# Altium schematic sheet IO&RF.SchDoc
size A4
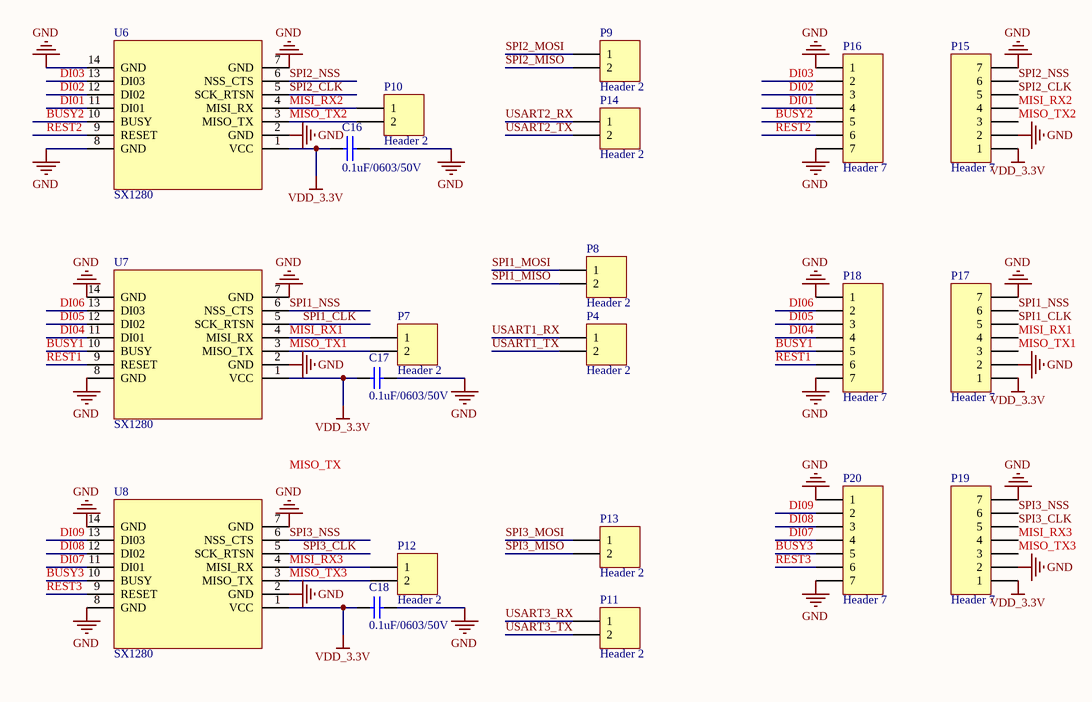
[diagram p0: IO&RF.SchDoc]

## Parts
C16  0.1uF/0603/50V  [0603]
C17  0.1uF/0603/50V  [0603]
C18  0.1uF/0603/50V  [0603]
P4  Header 2  [HDR1X2]
P7  Header 2  [HDR1X2]
P8  Header 2  [HDR1X2]
P9  Header 2  [HDR1X2]
P10  Header 2  [HDR1X2]
P11  Header 2  [HDR1X2]
P12  Header 2  [HDR1X2]
P13  Header 2  [HDR1X2]
P14  Header 2  [HDR1X2]
P15  Header 7  [HDR1X7]
P16  Header 7  [HDR1X7]
P17  Header 7  [HDR1X7]
P18  Header 7  [HDR1X7]
P19  Header 7  [HDR1X7]
P20  Header 7  [HDR1X7]
U6  SX1280  [PE28(2G4M12S)]
U7  SX1280  [PE28(2G4M12S)]
U8  SX1280  [PE28(2G4M12S)]

## Nets
GND: C16.1 C17.2 C18.2 P15.2 P15.7 P16.1 P16.7 P17.2 P17.7 P18.1 P18.7 P19.2 P19.7 P20.1 P20.7 U6.2(GND) U6.7(GND) U6.8(GND) U6.14(GND) U7.2(GND) U7.7(GND) U7.8(GND) U7.14(GND) U8.2(GND) U8.7(GND) U8.8(GND) U8.14(GND)
VDD_3.3V: C16.2 C17.1 C18.1 P15.1 P17.1 P19.1 U6.1(VCC) U7.1(VCC) U8.1(VCC)
BUSY1: P18.5 U7.10(BUSY)
BUSY2: P16.5 U6.10(BUSY)
BUSY3: P20.5 U8.10(BUSY)
DI01: P16.4 U6.11(DI01)
DI02: P16.3 U6.12(DI02)
DI03: P16.2 U6.13(DI03)
DI04: P18.4 U7.11(DI01)
DI05: P18.3 U7.12(DI02)
DI06: P18.2 U7.13(DI03)
DI07: P20.4 U8.11(DI01)
DI08: P20.3 U8.12(DI02)
DI09: P20.2 U8.13(DI03)
MISI_RX1: P7.1 P17.4 U7.4(MISI_RX)
MISI_RX2: P10.1 P15.4 U6.4(MISI_RX)
MISI_RX3: P12.1 P19.4 U8.4(MISI_RX)
MISO_TX1: P7.2 P17.3 U7.3(MISO_TX)
MISO_TX2: P10.2 P15.3 U6.3(MISO_TX)
MISO_TX3: P12.2 P19.3 U8.3(MISO_TX)
REST1: P18.6 U7.9(RESET)
REST2: P16.6 U6.9(RESET)
REST3: P20.6 U8.9(RESET)
SPI1_CLK: P17.5 U7.5(SCK_RTSN)
SPI1_MISO: P8.2
SPI1_MOSI: P8.1
SPI1_NSS: P17.6 U7.6(NSS_CTS)
SPI2_CLK: P15.5 U6.5(SCK_RTSN)
SPI2_MISO: P9.2
SPI2_MOSI: P9.1
SPI2_NSS: P15.6 U6.6(NSS_CTS)
SPI3_CLK: P19.5 U8.5(SCK_RTSN)
SPI3_MISO: P13.2
SPI3_MOSI: P13.1
SPI3_NSS: P19.6 U8.6(NSS_CTS)
USART1_RX: P4.1
USART1_TX: P4.2
USART2_RX: P14.1
USART2_TX: P14.2
USART3_RX: P11.1
USART3_TX: P11.2

## Notes on the sheet
- Labels drawn without touching a wire or pin: MISO_TX

## Library data of the parts
C16 = CAP: Capacitor
C17 C18 = Cap: Capacitor; Value: 0.1uF; Published: 8-Jun-2000; Revision: July-2002: Re-released for DXP Platform.; Publisher: Altium Limited
P4 P7-P14 = Header 2: Header, 2-Pin; LatestRevisionDate: 17-Jul-2002; LatestRevisionNote: Re-released for DXP Platform.; Publisher: Altium Limited
P15-P20 = Header 7: Header, 7-Pin; LatestRevisionDate: 17-Jul-2002; LatestRevisionNote: Re-released for DXP Platform.; Publisher: Altium Limited